# Altium schematic sheet stm32_core.SchDoc
size 292 x 203 mm
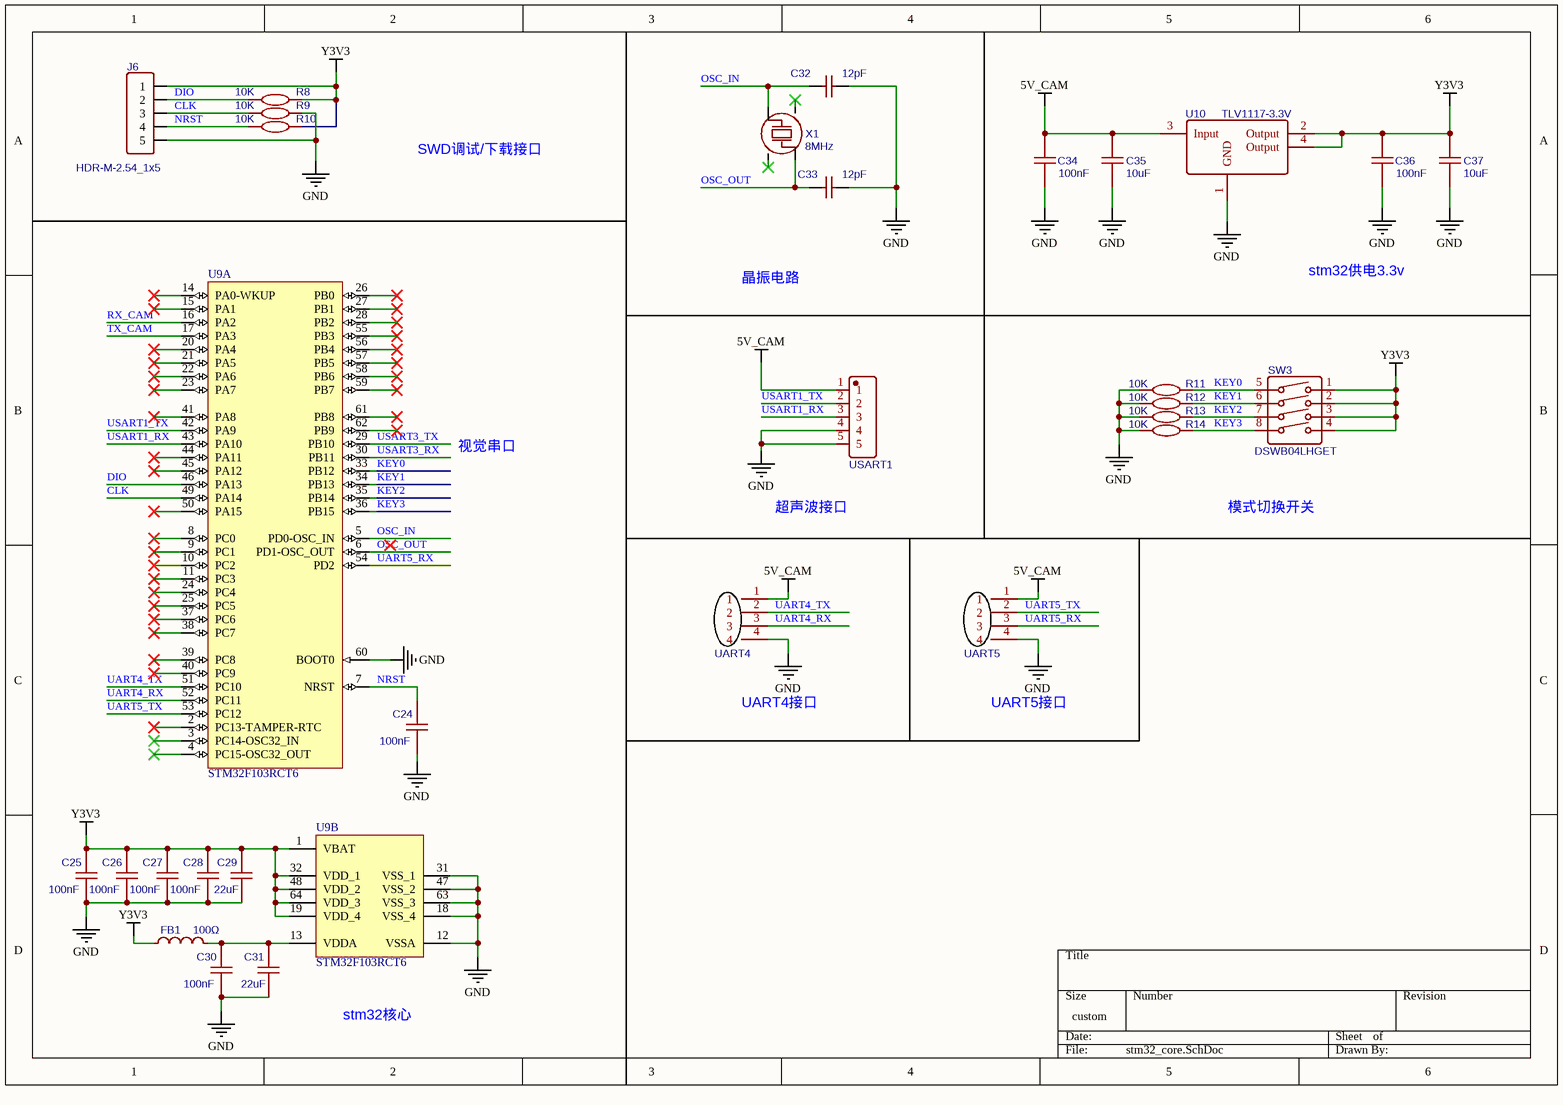
[diagram p0: stm32_core.SchDoc]

## Parts
C24  100nF  [C0402]
C25  100nF  [C0402]
C26  100nF  [C0402]
C27  100nF  [C0402]
C28  100nF  [C0402]
C29  22uF  [C0603]
C30  100nF  [C0402]
C31  22uF  [C0603]
C32  12pF  [C0402]
C33  12pF  [C0402]
C34  100nF  [C0402]
C35  10uF  [C0805]
C36  100nF  [C0402]
C37  10uF  [C0805]
FB1  100Ω  [L0603]
J6  HDR-M-2.54_1x5  [HDR-M-2.54_1X5]
R8  10K  [R0402]
R9  10K  [R0402]
R10  10K  [R0402]
R11  10K  [R0402]
R12  10K  [R0402]
R13  10K  [R0402]
R14  10K  [R0402]
SW3  DSWB04LHGET  [SW-TH_DSWB04LHGET]
U9  STM32F103RCT6  [STM-LQFP64_N]  (parts A,B of 2)
U10  TLV1117-3.3V  [SOT-223-4_L6.5-W3.5-P2.30-LS7.0-BR]
UART4  XH-4A  [CONN-TH_4P-P2.50_XH-4A]  (value not drawn)
UART5  XH-4A  [CONN-TH_4P-P2.50_XH-4A]  (value not drawn)
USART1  XH-5A  [CONN-TH_5P-P2.50_XH-5A_C2318]  (value not drawn)
X1  8MHz  [OSC-SMD_4P-L3.2-W2.5-BL]

## Nets
5V_CAM: C34.2 C35.2 U10.3(Input) UART4.1 UART5.1 USART1.1
GND: C24.1 C25.1 C26.1 C27.1 C28.1 C29.1 C30.1 C31.1 C32.1 C33.1 C34.1 C35.1 C36.1 C37.1 J6.5 R9.2 R11.1 R12.1 R13.1 R14.1 U9.12(VSSA) U9.18(VSS_4) U9.31(VSS_1) U9.47(VSS_2) U9.60(BOOT0) U9.63(VSS_3) U10.1(GND) UART4.4 UART5.4 USART1.4 USART1.5
Y3V3: C25.2 C26.2 C27.2 C28.2 C29.2 C36.2 C37.2 FB1.1 J6.1 R8.2 R10.2 SW3.1 SW3.2 SW3.3 SW3.4 U9.1(VBAT) U9.19(VDD_4) U9.32(VDD_1) U9.48(VDD_2) U9.64(VDD_3) U10.2(Output) U10.4(Output)
CLK: J6.3 R9.1 U9.49(PA14)
DIO: J6.2 R8.1 U9.46(PA13)
KEY0: R11.2 SW3.5 U9.33(PB12)
KEY1: R12.2 SW3.6 U9.34(PB13)
KEY2: R13.2 SW3.7 U9.35(PB14)
KEY3: R14.2 SW3.8 U9.36(PB15)
NRST: C24.2 J6.4 R10.1 U9.7(NRST)
OSC_IN: C32.2 U9.5(PD0-OSC_IN) X1.3
OSC_OUT: C33.2 U9.6(PD1-OSC_OUT) X1.1
RX_CAM: U9.16(PA2)
TX_CAM: U9.17(PA3)
UART4_RX: U9.52(PC11) UART4.3
UART4_TX: U9.51(PC10) UART4.2
UART5_RX: U9.54(PD2) UART5.3
UART5_TX: U9.53(PC12) UART5.2
USART1_RX: U9.43(PA10) USART1.3
USART1_TX: U9.42(PA9) USART1.2
USART3_RX: U9.30(PB11)
USART3_TX: U9.29(PB10)
NetC30_2: C30.2 C31.2 FB1.2 U9.13(VDDA)

Not connected (* = marked no-connect by the designer): U9 2(PC13-TAMPER-RTC)* 3(PC14-OSC32_IN)* 4(PC15-OSC32_OUT)* 8(PC0)* 9(PC1)* 10(PC2)* 11(PC3)* 14(PA0-WKUP)* 15(PA1)* 20(PA4)* 21(PA5)* 22(PA6)* 23(PA7)* 24(PC4)* 25(PC5)* 26(PB0)* 27(PB1)* 28(PB2)* 37(PC6)* 38(PC7)* 39(PC8)* 40(PC9)* 41(PA8)* 44(PA11)* 45(PA12)* 50(PA15)* 55(PB3)* 56(PB4)* 57(PB5)* 58(PB6)* 59(PB7)* 61(PB8)* 62(PB9)*; X1 2* 4*

## Notes on the sheet
- SWD调试/下载接口
- 晶振电路
- stm32供电3.3v
- 视觉串口
- 超声波接口
- 模式切换开关
- UART4接口
- UART5接口
- stm32核心

## Library data of the parts
C24-C28 C30 C34 C36 = 100nF: BOM_Manufacturer: Taiyo Yuden; BOM_Manufacturer Part: TMK105B7104KVHF; nameAlias: Capacitance; Contributor: LCSC; BOM_Supplier: LCSC; BOM_Supplier Part: C386075; spicePre: C; spiceSymbolName: TMK105B7104KVHF
C29 C31 = 22uF: BOM_Manufacturer: Taiyo Yuden; BOM_Manufacturer Part: LDK107BBJ226MA-T; nameAlias: Capacitance; Contributor: LCSC; BOM_Supplier: LCSC; BOM_Supplier Part: C337440; spicePre: C; spiceSymbolName: LDK107BBJ226MA-T
C32 C33 = 12pF: BOM_Manufacturer: TAIYO YUDEN; BOM_Manufacturer Part: UMK105CG120JV-F; nameAlias: Capacitance; BOM_Supplier: LCSC; BOM_Supplier Part: C92842; spicePre: C; spiceSymbolName: UMK105CG120JV-F
C35 C37 = 10uF: BOM_Manufacturer: Taiyo Yuden; BOM_Manufacturer Part: TMK212BBJ106KG-T; nameAlias: Capacitance; Contributor: LCSC; BOM_Supplier: LCSC; BOM_Supplier Part: C386085; spicePre: C; spiceSymbolName: TMK212BBJ106KG-T
FB1 = 100Ω: BOM_Manufacturer: TDK; BOM_Manufacturer Part: MPZ1608D101BTA00; nameAlias: Value; BOM_Supplier: LCSC; BOM_Supplier Part: C87554; spicePre: L; spiceSymbolName: MPZ1608D101BTA00
J6 = HDR-M-2.54_1x5: Contributor: LCEDA_Lib; BOM_Supplier Part: C358687; BOM_Supplier: LCSC; spicePre: J; spiceSymbolName: HDR-M-2.54_1x5
R8-R14 = 10K: BOM_Manufacturer: YAGEO; BOM_Manufacturer Part: AC0402FR-0710KL; nameAlias: Resistance (Ohms); Contributor: LCSC; BOM_Supplier: LCSC; BOM_Supplier Part: C144807; spicePre: R; spiceSymbolName: AC0402FR-0710KL
SW3 = DSWB04LHGET: BOM_Manufacturer: Dongguan Guangzhu Industrial; Contributor: LCSC; BOM_Paste Type: expand; BOM_Assembly Type: manualWeld; BOM_Supplier: LCSC; BOM_Supplier Part: C99418; BOM_Manufacturer Part: -; spicePre: S; spiceSymbolName: DSWB04LHGET
U9 = STM32F103RCT6: ARM Cortex-M3 32-bit MCU, 256 KB Flash, 48 KB Internal RAM, 51 I/Os, 64-pin LQFP, -40 to 85 degC, Tray; A/D Converter: 3x12-bit (16 Channel); D/A Converter: 2x12-bit (2 Channel); FLASH Size (Prog) (kB): 256; I/Os (High Current): 51; Internal RAM Size (kB): 48; Operating Frequency(F) (Processor speed) (MHz): 72; Supply Voltage(Vcc) min (V): 2; DatasheetVersion: Rev. 8; PackageVersion: Rev. 4, 06/2013; PackageReference: LQFP64; PackageDescription: 64-Pin Low Profile Quad Flat Package, 10 x 10 mm Body, 0.5 mm Pitch; Supplier 1: Digi-Key; Supplier Part Number 1: 497-9033-ND; Supplier 2: Newark; Supplier Part Number 2: 01P4099; Supplier 3: Newark; Supplier Part Number 3: 57P1227; Supplier 4: Mouser; Supplier Part Number 4: 511-STM32F103RCT6; Core: ARM Cortex-M3; Packing: Tray; Mounting Technology: Surface Mount; PartNumber: STM32F103RCT6; ComponentLink1Description: Manufacturer URL; ComponentLink1URL: http://www.st.com/web/en/home.html; ComponentLink2Description: Datasheet; ComponentLink2URL: http://www.st.com/st-web-ui/static/active/en/resource/technical/document/datasheet/CD00191185.pdf; ComponentLink3Description: Package Specification; ComponentLink3URL: http://www.st.com/st-web-ui/static/active/en/resource/technical/document/datasheet/DM00037051.pdf
U10 = TLV1117-3.3V: BOM_Manufacturer: TI; BOM_Manufacturer Part: TLV1117-33IDCYR; SMT Type: Extend; BOM_Supplier: LCSC; image: //image.lceda.cn/szlcsc/C37359.jpg; BOM_Supplier Part: C37359; BOM_JLCPCB SMD: Yes; spicePre: U; spiceSymbolName: TLV1117-33IDCYR
UART4 UART5 = XH-4A: BOM_Manufacturer: BOOMELE; SMT Type: Extend; BOM_Supplier: LCSC; BOM_Manufacturer Part: XH-4A; image: //image.lceda.cn/szlcsc/C37815.jpg; BOM_Supplier Part: C37815; BOM_JLCPCB SMD: Yes; spicePre: C; spiceSymbolName: XH-4A
USART1 = XH-5A: BOM_Manufacturer: BOOMELE; SMT Type: Extend; BOM_Supplier: LCSC; BOM_Manufacturer Part: XH-5A; image: //image.lceda.cn/szlcsc/C2318.jpg; BOM_Supplier Part: C2318; BOM_JLCPCB SMD: Yes; spicePre: C; spiceSymbolName: XH-5A
X1 = 8MHz: BOM_Manufacturer: Zhejiang Abel Elec; BOM_Manufacturer Part: TAXM8M4RDBCCT2T; nameAlias: Frequency; Contributor: LCSC; BOM_Paste Type: expand; BOM_Assembly Type: smtWeld; BOM_Supplier: LCSC; BOM_Supplier Part: C400090; spicePre: X; spiceSymbolName: TAXM8M4RDBCCT2T